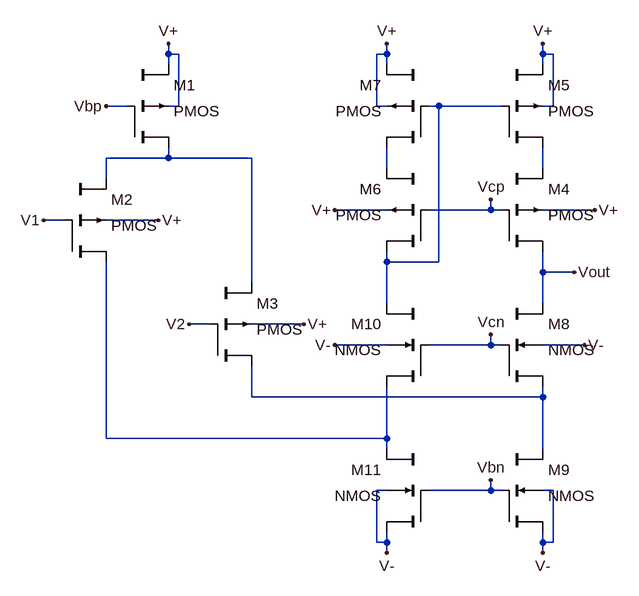
[diagram p0: schematic FCDAmp.asc]
FCDAmp.asc, the LTspice schematic file:
Version 4
SHEET 1 880 808
WIRE 144 -32 144 -48
WIRE 160 -32 144 -32
WIRE 480 -32 480 -48
WIRE 480 -32 464 -32
WIRE 720 -32 720 -48
WIRE 736 -32 720 -32
WIRE 144 -16 144 -32
WIRE 480 -16 480 -32
WIRE 720 -16 720 -32
WIRE 80 48 48 48
WIRE 160 48 160 -32
WIRE 160 48 144 48
WIRE 464 48 464 -32
WIRE 480 48 464 48
WIRE 560 48 544 48
WIRE 656 48 560 48
WIRE 736 48 736 -32
WIRE 736 48 720 48
WIRE 144 128 144 112
WIRE 144 128 48 128
WIRE 272 128 144 128
WIRE 480 144 480 112
WIRE 720 144 720 112
WIRE 48 160 48 128
WIRE 480 208 400 208
WIRE 640 208 640 192
WIRE 640 208 544 208
WIRE 656 208 640 208
WIRE 800 208 720 208
WIRE -16 224 -48 224
WIRE 128 224 48 224
WIRE 480 288 480 272
WIRE 560 288 560 48
WIRE 560 288 480 288
WIRE 720 304 720 272
WIRE 768 304 720 304
WIRE 272 320 272 128
WIRE 480 352 480 288
WIRE 720 352 720 304
WIRE 208 384 176 384
WIRE 352 384 272 384
WIRE 480 416 400 416
WIRE 640 416 640 400
WIRE 640 416 544 416
WIRE 656 416 640 416
WIRE 784 416 720 416
WIRE 272 496 272 448
WIRE 720 496 720 480
WIRE 720 496 272 496
WIRE 48 560 48 288
WIRE 480 560 480 480
WIRE 480 560 48 560
WIRE 480 576 480 560
WIRE 720 576 720 496
WIRE 480 640 464 640
WIRE 640 640 640 624
WIRE 640 640 544 640
WIRE 656 640 640 640
WIRE 736 640 720 640
WIRE 464 720 464 640
WIRE 480 720 480 704
WIRE 480 720 464 720
WIRE 720 720 720 704
WIRE 736 720 736 640
WIRE 736 720 720 720
WIRE 480 736 480 720
WIRE 720 736 720 720
FLAG 128 224 V+
FLAG 352 384 V+
FLAG 400 208 V+
FLAG 480 -48 V+
FLAG 720 -48 V+
FLAG 144 -48 V+
FLAG 400 416 V-
FLAG 784 416 V-
FLAG 720 736 V-
FLAG 480 736 V-
FLAG 800 208 V+
FLAG 768 304 Vout
FLAG -48 224 V1
FLAG 176 384 V2
FLAG 48 48 Vbp
FLAG 640 192 Vcp
FLAG 640 400 Vcn
FLAG 640 624 Vbn
SYMBOL cktsym\\pmos4 144 48 R0
SYMATTR InstName M1
SYMATTR Value2 l=1.8um w=36um
SYMBOL cktsym\\pmos4 48 224 R0
SYMATTR InstName M2
SYMATTR Value2 l=1.8um w=36um
SYMBOL cktsym\\pmos4 272 384 R0
SYMATTR InstName M3
SYMATTR Value2 l=1.8um w=36um
SYMBOL cktsym\\pmos4 720 208 R0
SYMATTR InstName M4
SYMATTR Value2 l=1.8um w=36um
SYMBOL cktsym\\pmos4 720 48 R0
SYMATTR InstName M5
SYMATTR Value2 l=1.8um w=36um
SYMBOL cktsym\\pmos4 480 208 M0
SYMATTR InstName M6
SYMATTR Value2 l=1.8um w=36um
SYMBOL cktsym\\pmos4 480 48 M0
SYMATTR InstName M7
SYMATTR Value2 l=1.8um w=36um
SYMBOL cktsym\\nmos4 720 416 R0
SYMATTR InstName M8
SYMATTR Value2 l=1.8um w=36um
SYMBOL cktsym\\nmos4 720 640 R0
SYMATTR InstName M9
SYMATTR Value2 l=1.8um w=36um
SYMBOL cktsym\\nmos4 480 416 M0
SYMATTR InstName M10
SYMATTR Value2 l=1.8um w=36um
SYMBOL cktsym\\nmos4 480 640 M0
SYMATTR InstName M11
SYMATTR Value2 l=1.8um w=36um

The netlist it stands for:
* FCDAmp.asc
M1 N002 Vbp V+ V+ PMOS l=1.8um w=36um
M2 N006 V1 N002 V+ PMOS l=1.8um w=36um
M3 N005 V2 N002 V+ PMOS l=1.8um w=36um
M4 Vout Vcp N004 V+ PMOS l=1.8um w=36um
M5 N004 N001 V+ V+ PMOS l=1.8um w=36um
M6 N001 Vcp N003 V+ PMOS l=1.8um w=36um
M7 N003 N001 V+ V+ PMOS l=1.8um w=36um
M8 Vout Vcn N005 V- NMOS l=1.8um w=36um
M9 N005 Vbn V- V- NMOS l=1.8um w=36um
M10 N001 Vcn N006 V- NMOS l=1.8um w=36um
M11 N006 Vbn V- V- NMOS l=1.8um w=36um
.model NMOS NMOS
.model PMOS PMOS
.lib standard.mos
.backanno
.end